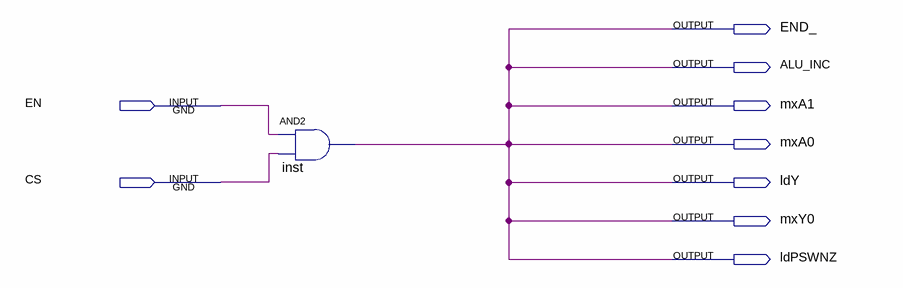
[diagram p0: schematic sheet]
// Quartus schematic INY.bdf as structural Verilog: 1 symbols, 9 pins
module INY (
  input  EN,
  input  CS,
  output END_,
  output ALU_INC,
  output mxA1,
  output mxA0,
  output ldY,
  output mxY0,
  output ldPSWNZ
);

  and inst (ALU_INC, EN, CS);

  assign END_ = ALU_INC;
  assign ldPSWNZ = ALU_INC;
  assign ldY = ALU_INC;
  assign mxA0 = ALU_INC;
  assign mxA1 = ALU_INC;
  assign mxY0 = ALU_INC;
endmodule
